# EAGLE design ViseraFPGA_v1_0 (EAGLE 9.3.0)
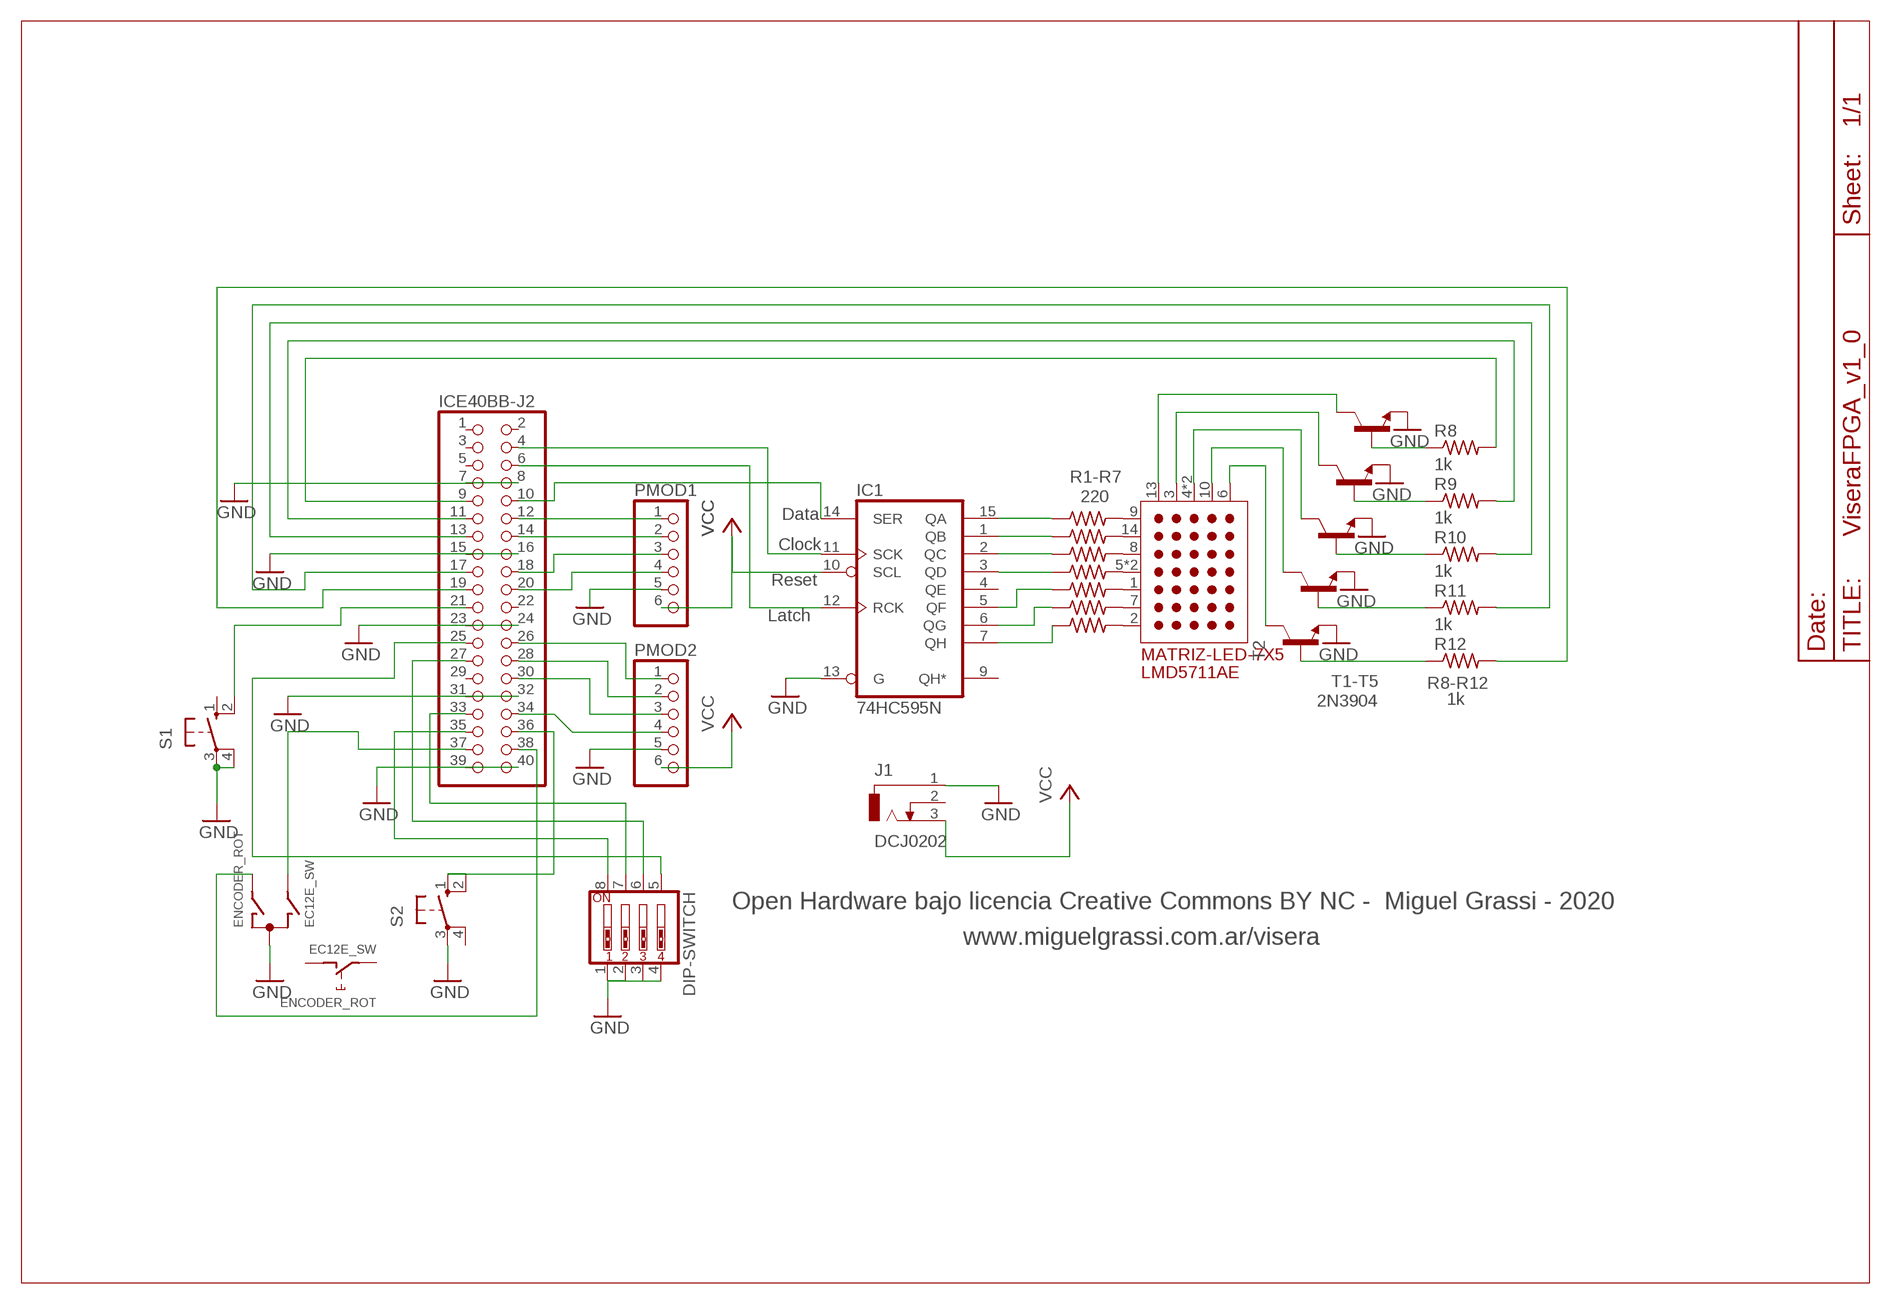
[diagram p0: schematic, sheet 1]

## Parts
DIP-SWITCH  SW_DIP-4  [EDG-04]
ENCODER_ROT  EC12E_SW  [ALPS_EC12E_SW]
IC1  74HC595N  [DIL16]
ICE40BB-J2  PINHD-2X20  [2X20]
J1  DCJ0202  [DCJ0202]
MATRIZ-LED-7X5  LMD5711AE  [LMD5711AE]
PMOD1  PINHD-1X6  [1X06]
PMOD2  PINHD-1X6  [1X06]
R1  220  R-US_0207/7  [0207/7]
R2  220  R-US_0207/7  [0207/7]
R3  220  R-US_0207/7  [0207/7]
R4  220  R-US_0207/7  [0207/7]
R5  220  R-US_0207/7  [0207/7]
R6  220  R-US_0207/7  [0207/7]
R7  220  R-US_0207/7  [0207/7]
R8  1k  R-US_0207/7  [0207/7]
R9  1k  R-US_0207/7  [0207/7]
R10  1k  R-US_0207/7  [0207/7]
R11  1k  R-US_0207/7  [0207/7]
R12  1k  R-US_0207/7  [0207/7]
S1  10-XX  [B3F-10XX]
S2  10-XX  [B3F-10XX]
T1  2N3904  [TO92]
T2  2N3904  [TO92]
T3  2N3904  [TO92]
T4  2N3904  [TO92]
T5  2N3904  [TO92]

## Nets
GND: DIP-SWITCH.1 DIP-SWITCH.2 DIP-SWITCH.3 DIP-SWITCH.4 ENCODER_ROT.C IC1.13(G) ICE40BB-J2.7 ICE40BB-J2.8 ICE40BB-J2.15 ICE40BB-J2.16 ICE40BB-J2.23 ICE40BB-J2.24 ICE40BB-J2.31 ICE40BB-J2.32 ICE40BB-J2.39 ICE40BB-J2.40 J1.1 PMOD1.5 PMOD2.5 S1.3(P) S1.4(P1) S2.3(P) T1.3(E) T2.3(E) T3.3(E) T4.3(E) T5.3(E)
N$1: MATRIZ-LED-7X5.9(R1) R1.2
N$2: MATRIZ-LED-7X5.14(R2) R2.2
N$3: MATRIZ-LED-7X5.8(R3) R3.2
N$4: MATRIZ-LED-7X5.5(R4) MATRIZ-LED-7X5.12(R4) R4.2
N$5: MATRIZ-LED-7X5.1(R5) R5.2
N$6: MATRIZ-LED-7X5.7(R6) R6.2
N$7: MATRIZ-LED-7X5.2(R7) R7.2
N$8: MATRIZ-LED-7X5.6(C5) T1.1(C)
N$9: MATRIZ-LED-7X5.10(C4) T2.1(C)
N$10: MATRIZ-LED-7X5.4(C3) MATRIZ-LED-7X5.11(C3) T3.1(C)
N$11: MATRIZ-LED-7X5.3(C2) T4.1(C)
N$12: MATRIZ-LED-7X5.13(C1) T5.1(C)
N$13: R8.1 T5.2(B)
N$14: R9.1 T4.2(B)
N$15: R10.1 T3.2(B)
N$16: R11.1 T2.2(B)
N$17: R12.1 T1.2(B)
N$18: IC1.15(QA) R1.1
N$19: ICE40BB-J2.9 R8.2
N$20: IC1.2(QC) R3.1
N$21: IC1.1(QB) R2.1
N$22: ICE40BB-J2.11 R9.2
N$23: ICE40BB-J2.13 R10.2
N$24: ICE40BB-J2.17 R11.2
N$25: ICE40BB-J2.19 R12.2
N$26: IC1.7(QH) R7.1
N$27: IC1.6(QG) R6.1
N$28: IC1.5(QF) R5.1
N$29: ICE40BB-J2.21 S1.2(S1)
N$30: ICE40BB-J2.36 S2.1(S) S2.2(S1)
N$31: DIP-SWITCH.5 ICE40BB-J2.25
N$32: DIP-SWITCH.6 ICE40BB-J2.27
N$33: DIP-SWITCH.7 ICE40BB-J2.33
N$34: DIP-SWITCH.8 ICE40BB-J2.35
N$35: ENCODER_ROT.B ICE40BB-J2.37
N$36: ENCODER_ROT.A ICE40BB-J2.38
N$37: ICE40BB-J2.12 PMOD1.1
N$38: IC1.11(SCK) ICE40BB-J2.4
N$39: IC1.12(RCK) ICE40BB-J2.6
N$40: IC1.14(SER) ICE40BB-J2.10
N$41: IC1.3(QD) R4.1
N$42: ICE40BB-J2.14 PMOD1.2
N$43: ICE40BB-J2.18 PMOD1.3
N$44: ICE40BB-J2.20 PMOD1.4
N$45: ICE40BB-J2.26 PMOD2.1
N$46: ICE40BB-J2.28 PMOD2.2
N$47: ICE40BB-J2.30 PMOD2.3
N$48: ICE40BB-J2.34 PMOD2.4
VCC: IC1.10(SCL) J1.3 PMOD1.6 PMOD2.6
Unconnected: ENCODER_ROT.D ENCODER_ROT.E ENCODER_ROT.GND1(G) ENCODER_ROT.GND2(G) IC1.4(QE) IC1.9(QH*) ICE40BB-J2.1 ICE40BB-J2.2 ICE40BB-J2.3 ICE40BB-J2.5 ICE40BB-J2.22 ICE40BB-J2.29 J1.2 S1.1(S) S2.4(P1)

## Notes on the sheet
- R1-R7
- Data
- Clock
- Reset
- Latch
- T1-T5 | R8-R12
- Open Hardware bajo licencia Creative Commons BY NC -  Miguel Grassi - 2020
- www.miguelgrassi.com.ar/visera

## Power pins joined to a net without a drawn wire
GND: IC1.8(GND)
VCC: IC1.16(VCC)

## Library data of the parts
DIP-SWITCH = special:SW_DIP-4: DIP SWITCH
ENCODER_ROT = switch-alps:EC12E_SW: ALPS rotary Encoder EC12E series with switch; MPN: EC12E2424407; OC_FARNELL: 1520813; OC_NEWARK: 74M1068
IC1 = 74xx-eu:74*595: 8-bit SHIFT REGISTER, output latch
ICE40BB-J2 = pinhead:PINHD-2X20: PIN HEADER
J1 = con-jack:DCJ0202: DC POWER JACK Source: DCJ0202.pdf; OC_FARNELL: unknown; OC_NEWARK: unknown
MATRIZ-LED-7X5 = ledmatrix:LMD5711AE: 5x7 Dot Matrix LED Display
PMOD1 PMOD2 = pinhead:PINHD-1X6: PIN HEADER
R1-R12 = resistor:R-US_: RESISTOR, American symbol
S1 S2 = switch-omron:10-XX: OMRON SWITCH; MPN: B3F-1000; OC_FARNELL: 176432; OC_NEWARK: 36M3542
T1-T5 = transistor:2N3904: NPN TRANSISTOR

## Board
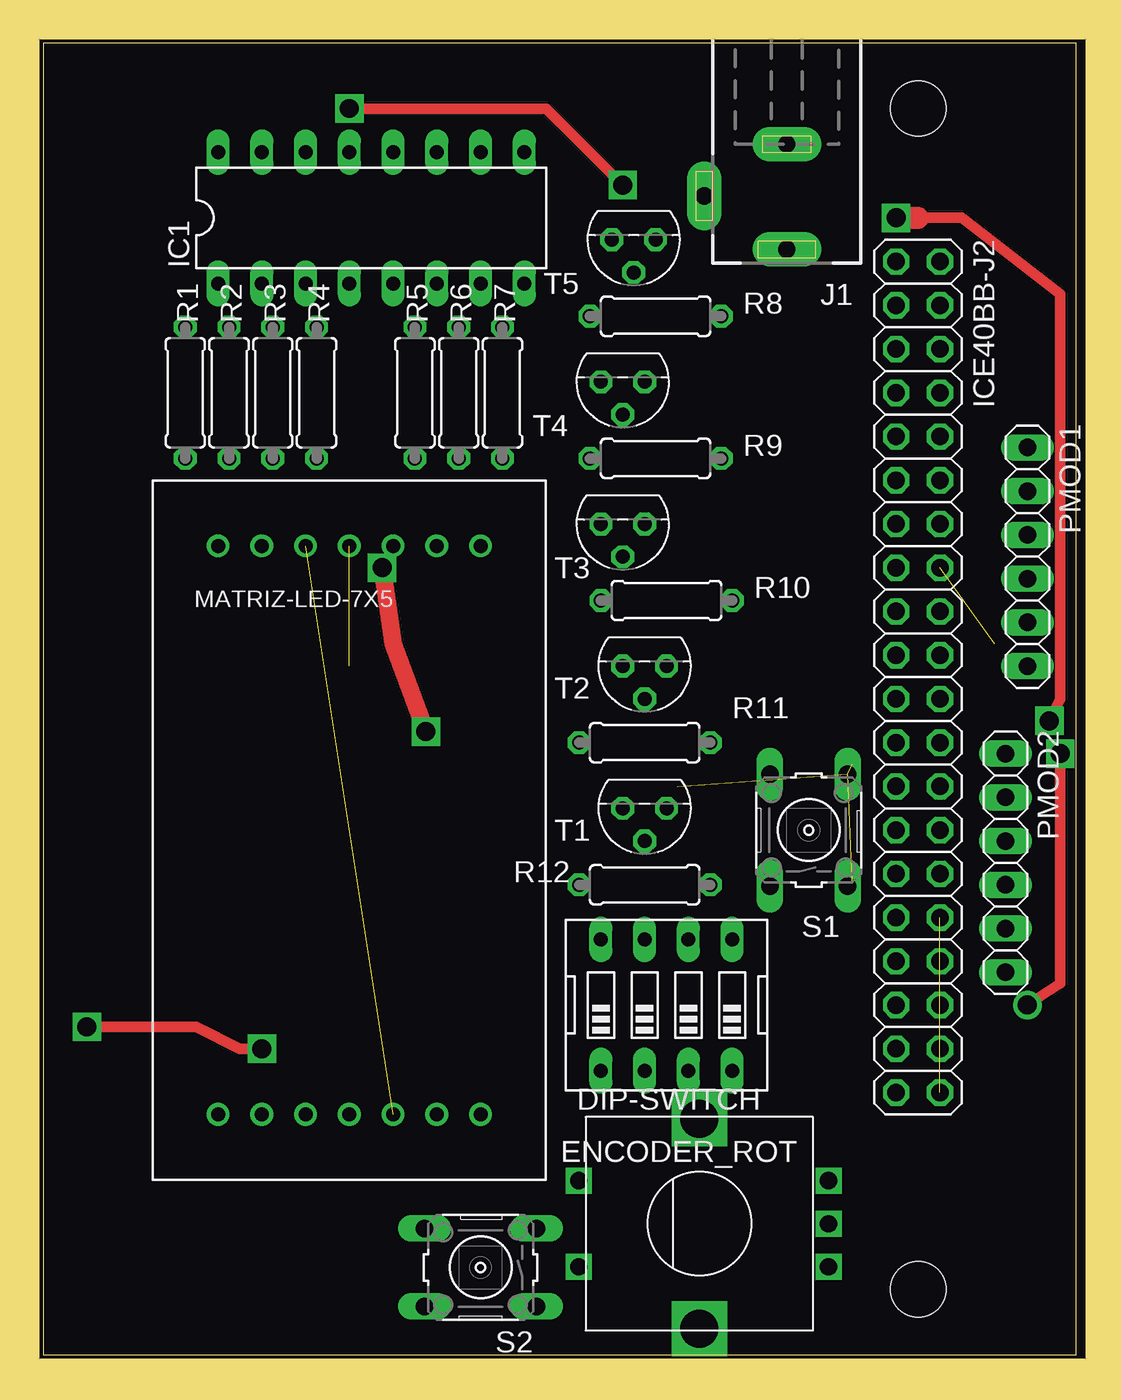
[diagram p1: board, top side]
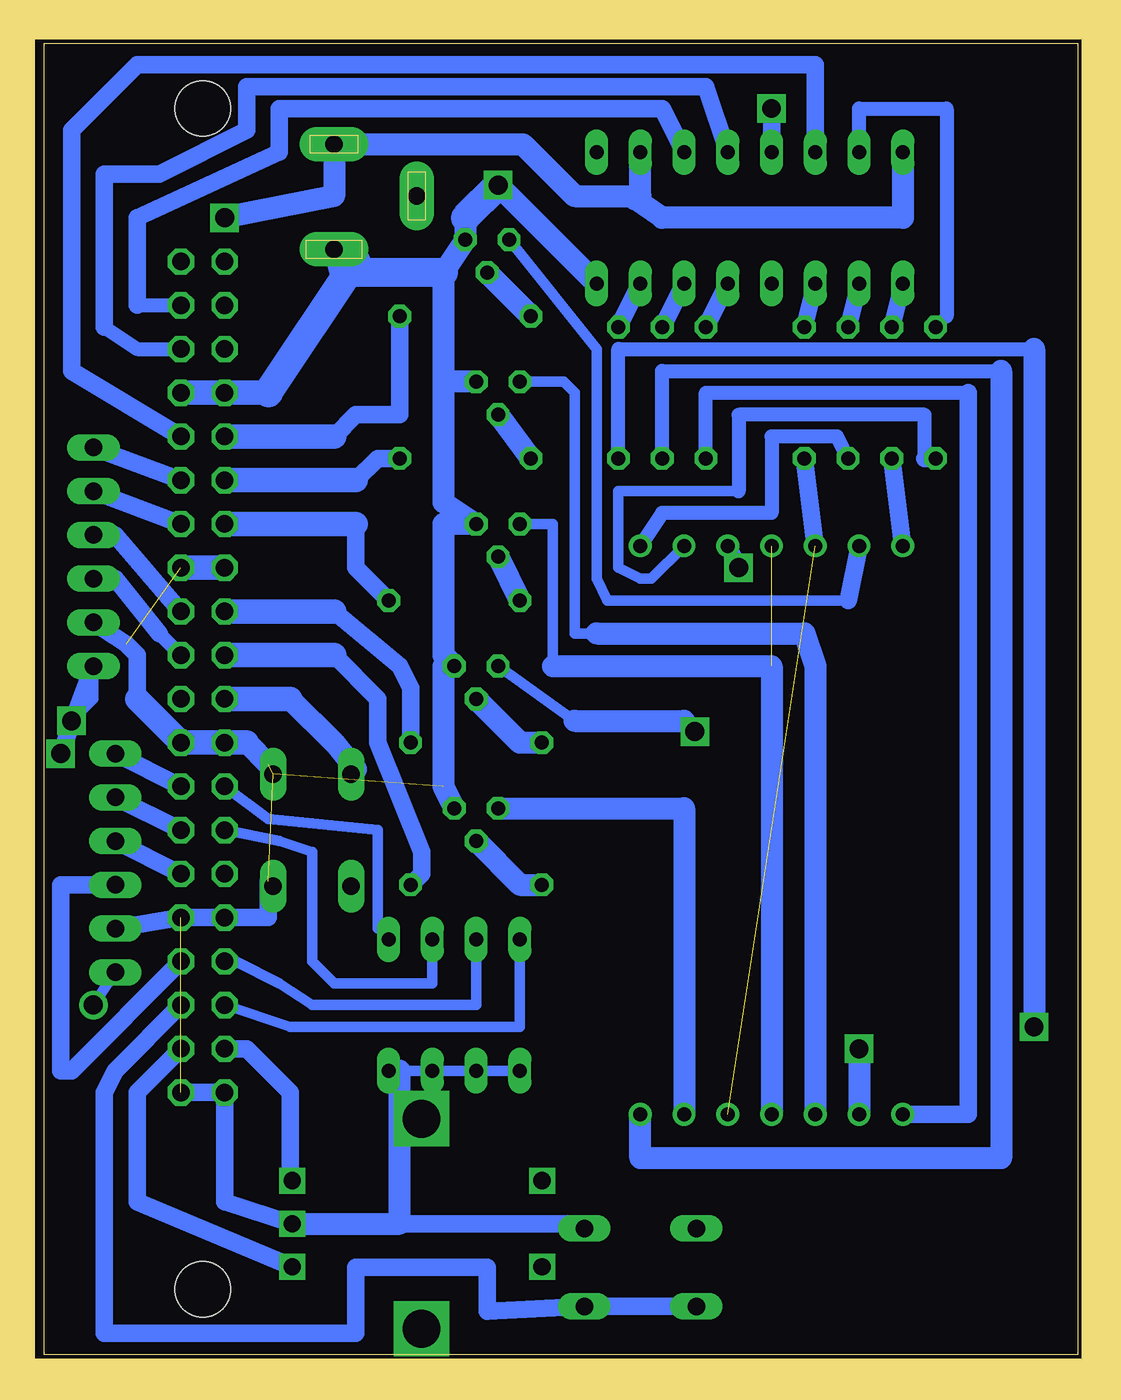
[diagram p2: board, bottom side, seen from below]

Size 59.99 x 76.19 mm. Coordinates in mm from the lower left corner, seen from the top.
Outline: 0,0 59.99,0 59.99,76.19 0,76.19 0,0
Copper layers (1*16): Top 0.035mm / dielectric 1.5mm / Bottom 0.035mm
Design rules "default": minimum track width 10mil, minimum drill 24mil, track to track 8mil, track to pad 8mil, pad to pad 8mil, via to via 8mil, smd to smd 8mil, copper to edge 40mil, drill to drill 8mil, minimum pad ring 10mil, minimum via ring 8mil, stop-mask expansion 4mil, vias tented up to drill 0mil, thermal gap 10mil
Holes 3.2 mm at 50.8,3.81 50.8,72.39
Milling: 4 lines

### Footprints (pad centres in the part's own frame; a part is rotated, then mirrored left to right if it is on the bottom)
EDG-04 = drill 0.813 long: 1 -3.81,-3.81; 2 -1.27,-3.81; 3 1.27,-3.81; 4 3.81,-3.81; 5 3.81,3.81; 6 1.27,3.81; 7 -1.27,3.81; 8 -3.81,3.81
ALPS_EC12E_SW = drill 1 square: A -2.5,-7.5; B 2.5,-7.5; C 0,-7.5; D -2.5,7; E 2.5,7 | drill 2.2 square: GND1 -6.1,0; GND2 6.1,0
DIL16 = drill 0.813 long: 1 -8.89,-3.81; 2 -6.35,-3.81; 3 -3.81,-3.81; 4 -1.27,-3.81; 5 1.27,-3.81; 6 3.81,-3.81; 7 6.35,-3.81; 8 8.89,-3.81; 9 8.89,3.81; 10 6.35,3.81; 11 3.81,3.81; 12 1.27,3.81; 13 -1.27,3.81; 14 -3.81,3.81; 15 -6.35,3.81; 16 -8.89,3.81
2X20 = drill 1.016 octagon: 1 -24.13,-1.27; 2 -24.13,1.27; 3 -21.59,-1.27; 4 -21.59,1.27; 5 -19.05,-1.27; 6 -19.05,1.27; 7 -16.51,-1.27; 8 -16.51,1.27; 9 -13.97,-1.27; 10 -13.97,1.27; 11 -11.43,-1.27; 12 -11.43,1.27; 13 -8.89,-1.27; 14 -8.89,1.27; 15 -6.35,-1.27; 16 -6.35,1.27; 17 -3.81,-1.27; 18 -3.81,1.27; 19 -1.27,-1.27; 20 -1.27,1.27; 21 1.27,-1.27; 22 1.27,1.27; 23 3.81,-1.27; 24 3.81,1.27; 25 6.35,-1.27; 26 6.35,1.27; 27 8.89,-1.27; 28 8.89,1.27; 29 11.43,-1.27; 30 11.43,1.27; 31 13.97,-1.27; 32 13.97,1.27; 33 16.51,-1.27; 34 16.51,1.27; 35 19.05,-1.27; 36 19.05,1.27; 37 21.59,-1.27; 38 21.59,1.27; 39 24.13,-1.27; 40 24.13,1.27
DCJ0202 = drill 1 pad 2 long: 1 0,3.1; 2 4.8,0; 3 0,-3
LMD5711AE = drill 0.813: 1 -7.62,-16.51; 2 -5.08,-16.51; 3 -2.54,-16.51; 4 0,-16.51; 5 2.54,-16.51; 6 5.08,-16.51; 7 7.62,-16.51; 8 7.62,16.51; 9 5.08,16.51; 10 2.54,16.51; 11 0,16.51; 12 -2.54,16.51; 13 -5.08,16.51; 14 -7.62,16.51
1X06 = drill 1.016 long: 1 -6.35,0; 2 -3.81,0; 3 -1.27,0; 4 1.27,0; 5 3.81,0; 6 6.35,0
0207/7 = drill 0.813 octagon: 1 -3.81,0; 2 3.81,0
B3F-10XX = drill 1.016 long: 1 -3.251,2.261; 2 3.251,2.261; 3 -3.251,-2.261; 4 3.251,-2.261
TO92 = drill 0.813 octagon: 1 1.27,0; 2 0,1.905; 3 -1.27,0

### Placement (x,y rotation side)
DIP-SWITCH  36.2,20.32 0 top
ENCODER_ROT  38.1,7.62 90 top
IC1  19.05,66.04 0 top
ICE40BB-J2  50.8,39.37 270 top
J1  43.18,67.31 180 top
MATRIZ-LED-7X5  17.78,30.48 0 top
PMOD1  57.15,46.35 270 top
PMOD2  55.88,28.57 270 top
R1  8.26,55.88 270 top
R2  10.79,55.88 270 top
R3  13.34,55.88 270 top
R4  15.88,55.88 270 top
R5  21.59,55.88 270 top
R6  24.13,55.88 270 top
R7  26.67,55.88 270 top
R8  35.56,60.33 0 top
R9  35.56,52.07 0 top
R10  36.2,43.81 0 top
R11  34.92,35.56 0 top
R12  34.92,27.3 0 top
S1  44.45,30.48 90 top
S2  25.4,5.08 180 top
T1  34.92,31.75 180 top
T2  34.92,40.01 180 top
T3  33.66,48.26 180 top
T4  33.66,56.52 180 top
T5  34.29,64.77 180 top

### Tracks (layer width: path | path; a pad name or v marks a point on that pad's centre or on a via)
GND  (via drill 1.1)  (5 unrouted)
  Top 0.61: v17.78,72.39 29.21,72.39 v33.66,67.94
  Bottom 0.61: 42.47,62.87 J1.1 | 41.91,63.5 42.62,62.23 | DIP-SWITCH.1 DIP-SWITCH.2 DIP-SWITCH.3 39.37,16.51 DIP-SWITCH.4
  Bottom 1.016: IC1.13 v17.78,72.39 | S1.3 46.99,27.51 46.99,25.4 ICE40BB-J2.31 ICE40BB-J2.32 PMOD2.5 | ICE40BB-J2.40 ICE40BB-J2.39 49.53,8.89 ENCODER_ROT.C | 39.37,7.62 29.21,7.62 S2.3 | 54.61,38.1 54.61,40.64 55.24,41.27 PMOD1.5
  Bottom 1.27: v33.66,67.94 IC1.8 | T4.3 36.83,56.52 | 36.83,56.52 36.83,49.53 T3.3 36.83,48.26 36.83,40.64 T2.3 36.83,40.01 36.83,33.02 T1.3 | ICE40BB-J2.7 ICE40BB-J2.8 | 36.83,56.52 36.83,62.87 T5.3 35.56,66.04 | 42.62,62.23 J1.1 | 48.26,35.56 46.99,34.29 | ENCODER_ROT.C 39.37,7.62 39.37,16.51
  Bottom 1.422: ICE40BB-J2.8 46.99,55.88 | ICE40BB-J2.15 ICE40BB-J2.16 | 48.26,35.56 ICE40BB-J2.23 ICE40BB-J2.24 54.61,38.1
  Bottom 1.676: 36.83,62.87 42.47,62.87 | v33.66,67.94 35.56,66.04 | 46.99,55.88 41.91,63.5
N$1
  Bottom 0.61: 19.68,50.16 26.67,50.16 26.67,45.72 25.4,45.09 24.77,45.09 MATRIZ-LED-7X5.9
  Bottom 0.813: 8.89,52.07 8.89,54.61 19.68,54.61 19.68,50.16
  Bottom 1.016: R1.2 8.89,52.07
N$2
  Bottom 1.016: R2.2 MATRIZ-LED-7X5.14
N$3
  Bottom 0.813: R3.2 13.97,53.34 17.78,53.34 17.78,48.9 24.13,48.9 MATRIZ-LED-7X5.8
N$4  (1 unrouted)
  Bottom 1.016: R4.2 MATRIZ-LED-7X5.12
N$5
  Bottom 0.813: R5.2 21.59,55.88 6.35,55.88
  Bottom 1.016: 6.35,55.88 6.35,13.97 MATRIZ-LED-7X5.1
N$6
  Bottom 0.813: R6.2 24.13,57.15 4.45,57.15
  Bottom 1.27: 4.45,57.15 4.45,11.43 25.4,11.43 MATRIZ-LED-7X5.7
N$7  (via drill 1.1)
  Top 0.61: v2.54,19.05 8.89,19.05 11.43,17.78 v12.7,17.78
  Bottom 0.813: R7.2 26.67,58.42 2.54,58.42
  Bottom 1.27: 2.54,58.42 v2.54,19.05 | v12.7,17.78 MATRIZ-LED-7X5.2
N$8
  Bottom 1.27: T1.1 22.86,31.75 MATRIZ-LED-7X5.6
N$9  (via drill 1.1)
  Top 1.016: v22.23,36.2 20.32,41.27 v19.68,45.72
  Bottom 0.61: T2.1 29.21,36.83 | 22.86,36.83 v22.23,36.2
  Bottom 1.016: v19.68,45.72 MATRIZ-LED-7X5.10
  Bottom 1.27: 29.21,36.83 22.86,36.83
N$10  (1 unrouted)
  Bottom 0.61: T3.1 30.48,48.26 30.48,40.01
  Bottom 1.27: MATRIZ-LED-7X5.4 17.78,40.01 30.48,40.01
N$11
  Bottom 0.61: T4.1 29.84,56.52 29.21,55.88 29.21,41.91 27.94,41.91
  Bottom 1.27: MATRIZ-LED-7X5.3 15.24,40.01 15.88,41.91 27.94,41.91
N$12
  Bottom 0.61: 13.34,43.81 27.3,43.81 27.94,45.09 27.94,58.42 T5.1
  Bottom 1.016: 13.34,43.81 MATRIZ-LED-7X5.13
N$13
  Bottom 1.27: T5.2 R8.1
N$14
  Bottom 1.27: T4.2 R9.1
N$15
  Bottom 1.27: T3.2 R10.1
N$16
  Bottom 1.27: T2.2 32.38,35.56 R11.1
N$17
  Bottom 1.27: T1.2 32.38,27.3 R12.1
N$18
  Bottom 0.61: 7.62,60.33 R1.1
  Bottom 0.813: IC1.15 12.7,72.39 7.62,72.39 7.62,60.33
N$19
  Bottom 1.016: R8.2 39.37,54.61 41.91,54.61 43.18,53.34
  Bottom 1.422: 43.18,53.34 ICE40BB-J2.9
N$20
  Bottom 1.016: IC1.2 R3.1
N$21
  Bottom 1.016: IC1.1 R2.1
N$22
  Bottom 1.016: R9.2 40.64,52.07 41.91,50.8
  Bottom 1.422: 41.91,50.8 ICE40BB-J2.11
N$23
  Bottom 1.016: 41.91,48.26 41.91,45.72 R10.2
  Bottom 1.422: ICE40BB-J2.13 41.91,48.26
N$24
  Bottom 1.016: 43.18,43.18 39.37,40.01 38.73,38.73 R11.2
  Bottom 1.422: ICE40BB-J2.17 43.18,43.18
N$25
  Bottom 1.016: 43.18,40.64 40.64,38.1 40.64,35.56 38.1,29.21 38.1,27.94 R12.2
  Bottom 1.422: ICE40BB-J2.19 43.18,40.64
N$26
  Bottom 1.016: IC1.7 R7.1
N$27
  Bottom 1.016: IC1.6 R6.1
N$28
  Bottom 1.016: IC1.5 R5.1
N$29
  Bottom 0.61: 41.91,34.01 S1.2
  Bottom 1.27: 45.72,38.1 43.18,35.56 41.91,34.01
  Bottom 1.422: ICE40BB-J2.21 45.72,38.1
N$30
  Bottom 1.016: S2.2 S2.1 34.29,2.54 34.29,5.08 41.91,5.08 41.91,1.27 56.52,1.27 56.52,15.24 55.88,16.51 ICE40BB-J2.36
N$31
  Bottom 0.406: 40.64,24.77 40.01,24.77 DIP-SWITCH.5
  Bottom 0.61: ICE40BB-J2.25 46.99,31.11 40.64,30.48 40.64,24.77
N$32
  Bottom 0.61: ICE40BB-J2.27 46.35,29.84 44.45,29.21 44.45,22.86 43.18,21.59 37.47,21.59 DIP-SWITCH.6
N$33
  Bottom 0.61: ICE40BB-J2.33 48.9,22.86 46.35,21.59 44.45,20.32 34.92,20.32 DIP-SWITCH.7
N$34
  Bottom 0.61: ICE40BB-J2.35 45.72,19.05 32.38,19.05 DIP-SWITCH.8
N$35
  Bottom 1.016: ICE40BB-J2.37 48.26,17.78 45.72,15.24 45.72,10.16 arc-11 ENCODER_ROT.B
N$36
  Bottom 1.016: ENCODER_ROT.A 54.61,8.89 54.61,15.24 ICE40BB-J2.38
N$37
  Bottom 1.016: ICE40BB-J2.12 PMOD1.1
N$38
  Bottom 0.813: 54.61,60.96 ICE40BB-J2.4
  Bottom 1.016: IC1.11 24.13,72.39 46.35,72.39 46.35,69.85 54.61,66.04 54.61,60.96
N$39
  Bottom 0.813: 56.52,59.69 54.61,58.42 ICE40BB-J2.6
  Bottom 1.016: IC1.12 21.59,73.66 48.26,73.66 48.26,71.12 53.34,68.58 56.52,68.58 56.52,59.69
N$40
  Bottom 1.016: IC1.14 15.24,74.93 54.61,74.93 58.42,71.12 58.42,57.15 ICE40BB-J2.10
N$41
  Bottom 1.016: IC1.3 R4.1
N$42
  Bottom 1.016: ICE40BB-J2.14 PMOD1.2
N$43
  Bottom 0.813: 55.88,47.62 PMOD1.3
  Bottom 1.016: ICE40BB-J2.18 55.88,47.62
N$44
  Bottom 0.813: ICE40BB-J2.20 53.34,41.91 | 55.88,45.09 PMOD1.4
  Bottom 1.016: 53.34,41.91 55.88,45.09
N$45
  Bottom 1.016: ICE40BB-J2.26 PMOD2.1
N$46
  Bottom 1.016: ICE40BB-J2.28 PMOD2.2
N$47
  Bottom 1.016: ICE40BB-J2.30 PMOD2.3
N$48
  Bottom 1.016: ICE40BB-J2.34 58.42,16.51 59.05,16.51 59.05,27.3 PMOD2.4
VCC  (via drill 1.1)
  Top 0.61: 50.8,66.04 53.34,66.04 59.05,61.59 59.05,38.1 v58.42,36.83 | v59.05,34.92 59.05,21.59 v57.15,20.32
  Top 1.27: v49.53,66.04 50.8,66.04
  Bottom 0.61: v58.42,36.83 57.15,38.1 PMOD1.6 | v57.15,20.32 PMOD2.6
  Bottom 1.016: PMOD1.6 v59.05,34.92
  Bottom 1.27: IC1.16 10.16,66.04 24.13,66.04 25.69,67.11 | 25.69,67.11 25.4,67.31 IC1.10 | 25.69,67.11 25.89,67.31 29.21,67.31 32.21,70.31 J1.3 43.18,67.31 v49.53,66.04